# EAGLE design schematic3 (EAGLE 9.0.1)
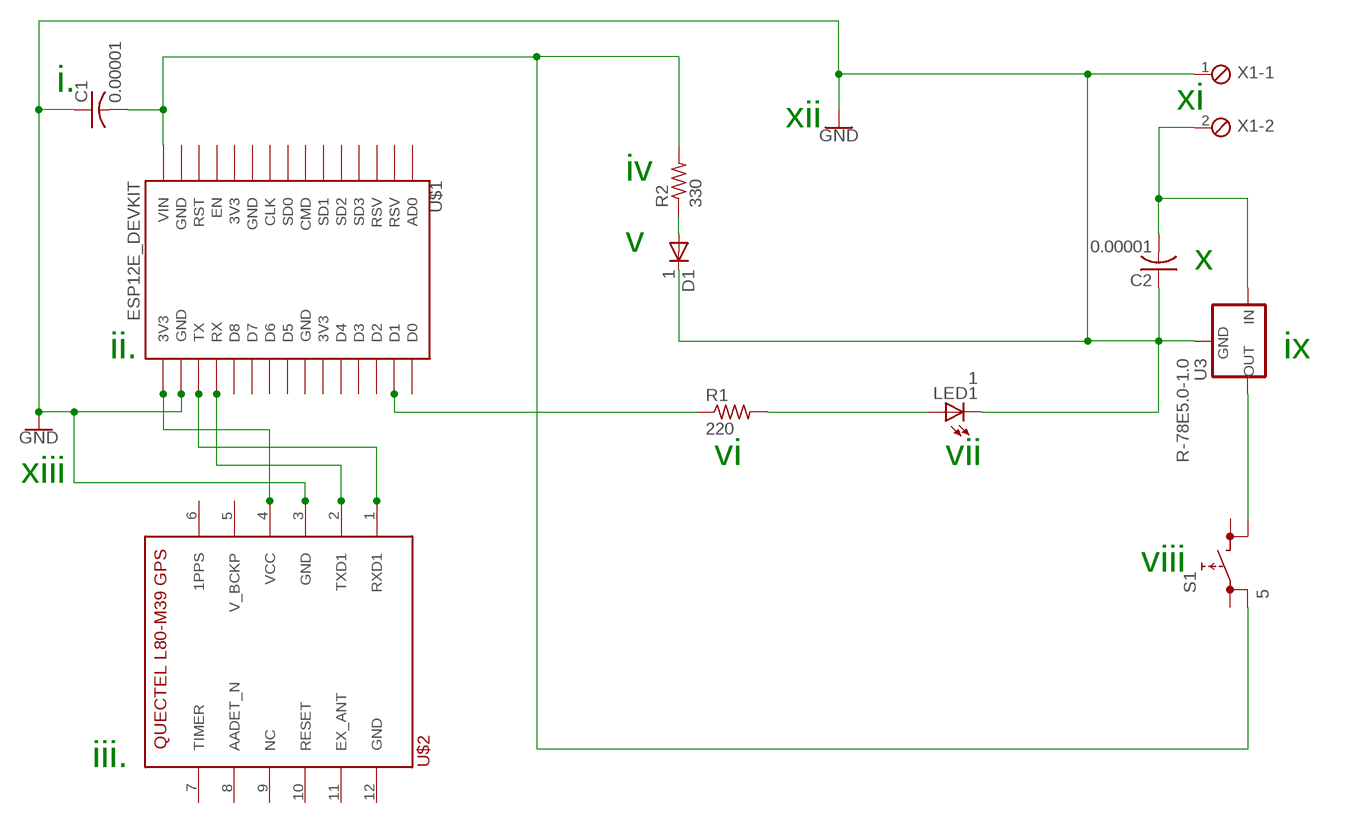
[diagram p0: schematic, sheet 1]

## Parts
C1  0.00001  C-US050-025X075  [C050-025X075]
C2  0.00001  C-US050-025X075  [C050-025X075]
D1  1  EGP10A  [DO41-10]
LED1  1  LED5MM  [LED5MM]
R1  220  R-US_0204/7  [0204/7]
R2  330  R-US_0204/7  [0204/7]
S1  5  REKN  [REKN]
U3  R-78E5.0-1.0  [DC-DC_CONVERTER_78XX]
U$1  ESP12E_DEVKIT  [ESP12E_DEVKIT]
U$2  L80_GNSS_MODULE  [L80_PACKAGE]
X1  MPT2  [2POL254]

## Nets
GND: C1.1 C2.1 D1.C LED1.K(C) U3.GND U$1.GND@3(GND) U$2.3(GND) X1.1
N$1: D1.A R2.1
N$2: C2.2 U3.VIN(IN) X1.2
N$3: S1.1B U3.VOUT(OUT)
N$4: R1.1 U$1.D1
N$5: U$1.3V3@2(3V3) U$2.4(VCC)
N$6: C1.2 R2.2 S1.0B U$1.VIN
N$7: LED1.A R1.2
N$9: U$1.RX U$2.2(TXD1)
N$10: U$1.TX U$2.1(RXD1)
Unconnected: S1.0A S1.1A U$1.3V3@0(3V3) U$1.3V3@1(3V3) U$1.AD0 U$1.CLK U$1.CMD U$1.D0 U$1.D2 U$1.D3 U$1.D4 U$1.D5 U$1.D6 U$1.D7 U$1.D8 U$1.EN U$1.GND@0(GND) U$1.GND@1(GND) U$1.GND@2(GND) U$1.RST U$1.RSV@0(RSV) U$1.RSV@1(RSV) U$1.SD0 U$1.SD1 U$1.SD2 U$1.SD3 U$2.5(V_BCKP) U$2.6(1PPS) U$2.7(TIMER) U$2.8(AADET_N) U$2.9(NC) U$2.10(RESET) U$2.11(EX_ANT) U$2.12(GND)

## Notes on the sheet
- i.
- xi
- xii
- iv
- v
- x
- ii. | ix
- vi | vii
- xiii
- viii
- iii.

## Library data of the parts
C1 C2 = resistor:C-US: CAPACITOR, American symbol
D1 = diode:EGP10A: DIODE ultra fast-recovery rectifier
LED1 = led:LED: LED OSRAM: - CHIPLED LG R971, LG N971, LY N971, LG Q971, LY Q971, LO R971, LY R971 LH N974, LH R974 LS Q976, LO Q976, LY Q976 LO Q996 - Hyper CHIPLED LW Q18S LB Q993, LB Q99A, LB R99A - SideLED LS A670, LO A670, LY A670, LG A670, LP A670 LB A673, LV A673, LT A673, LW A673 LH A674 LY A675 LS A676, LA A676, LO A676, LY A676, LW A676 LS A679, LY A679, LG A679 - Hyper Micro SIDELED® LS Y876, LA Y876, LO Y876, LY Y876 LT Y87S - SmartLED LW L88C, LW L88S LB L89C, LB L89S, LG L890 LS L89K, LO L89K, LY L89K LS L896, LA L896, LO L896, LY L896 - TOPLED LS T670, LO T670, LY T670, LG T670, LP T670 LSG T670, LSP T670, LSY T670, LOP T670, LYG T670 LG T671, LOG T671, LSG T671 LB T673, LV T673, LT T673, LW T673 LH T674 LS T676, LA T676, LO T676, LY T676, LB T676, LH T676, LSB T676, LW T676 LB T67C, LV T67C, LT T67C, LS T67K, LO T67K, LY T67K, LW E67C LS E67B, LA E67B, LO E67B, LY E67B, LB E67C, LV E67C, LT E67C LW T67C LS T679, LY T679, LG T679 LS T770, LO T770, LY T770, LG T770, LP T770 LB T773, LV T773, LT T773, LW T773 LH T774 LS E675, LA E675, LY E675, LS T675 LS T776, LA T776, LO T776, LY T776, LB T776 LHGB T686 LT T68C, LB T68C - Hyper Mini TOPLED® LB M676 - Mini TOPLED Santana® LG M470 LS M47K, LO M47K, LY M47K Source: http://www.osram.convergy.de LUXEON: - LUMILED® LXK2-PW12-R00, LXK2-PW12-S00, LXK2-PW14-U00, LXK2-PW14-V00 LXK2-PM12-R00, LXK2-PM12-S00, LXK2-PM14-U00 LXK2-PE12-Q00, LXK2-PE12-R00, LXK2-PE12-S00, LXK2-PE14-T00, LXK2-PE14-U00 LXK2-PB12-K00, LXK2-PB12-L00, LXK2-PB12-M00, LXK2-PB14-N00, LXK2-PB14-P00, LXK2-PB14-Q00 LXK2-PR12-L00, LXK2-PR12-M00, LXK2-PR14-Q00, LXK2-PR14-R00 LXK2-PD12-Q00, LXK2-PD12-R00, LXK2-PD12-S00 LXK2-PH12-R00, LXK2-PH12-S00 LXK2-PL12-P00, LXK2-PL12-Q00, LXK2-PL12-R00 Source: www.luxeon.com KINGBRIGHT: KA-3528ASYC Source: www.kingbright.com
R1 R2 = resistor:R-US_: RESISTOR, American symbol
S1 = switch:REKN: PUSH SWITCH ITT-Cannon-Cannon
U3 = SparkFun-IC-Power:R-78E5.0-1.0: Recom Power 5V 1A DC/DC Converter The Recom R-78E5.0-X.X is a compact DC/DC converter module that is a pin for pin drop-in replacement for the LM7805 linear voltage regulator. Specifications: Input Range: 7-28V Output Voltage: 5V Output Current: 1A Max Efficiency: 91% Datasheet <https://www.recom-power.com/pdf/Innoline/R-78Exx-1.0.pdf>; PROD_ID: COM-13655
U$1 = ESP12E_DEVKIT:ESP12E_DEVKIT: ESP12E DEVKIT BOARD
U$2 = Quectel:L80_GNSS_MODULE: GPS module with an embedded patch antenna (15mmx15mmx4mm)
X1 = con-phoenix-254:MPT2: PHOENIX CONNECTOR; OC_FARNELL: unknown; OC_NEWARK: unknown

## Board
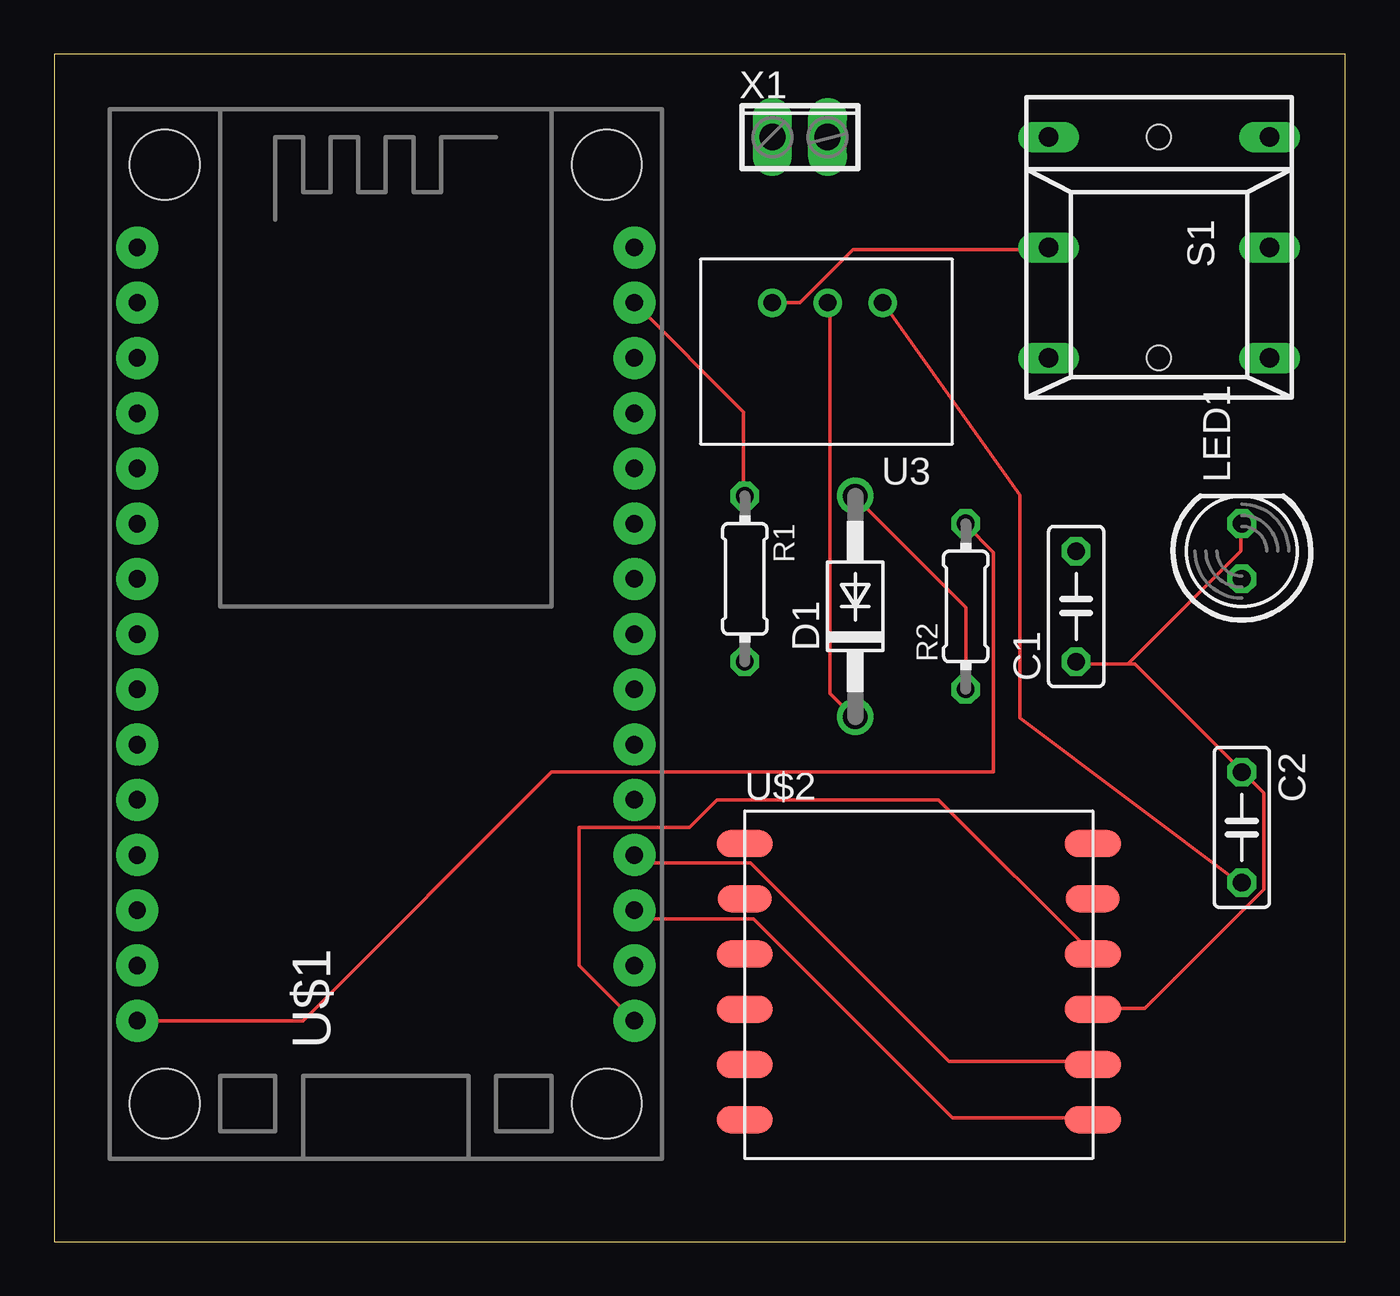
[diagram p1: board, top side]
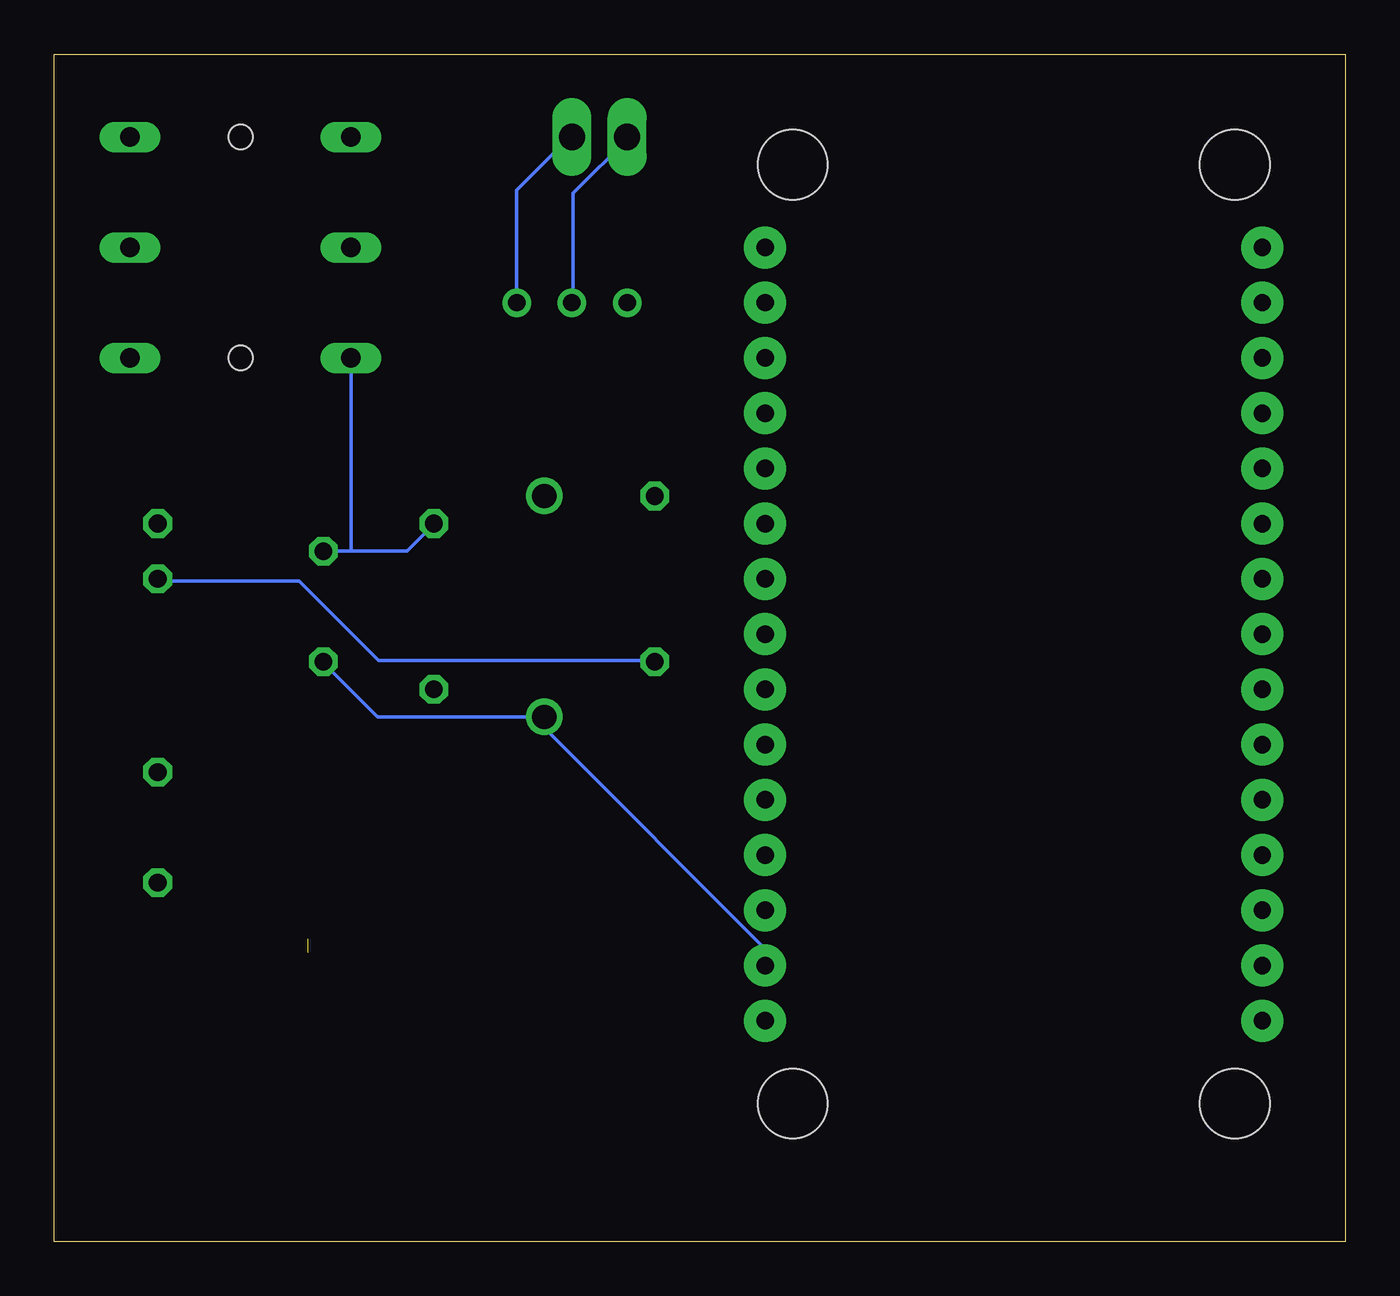
[diagram p2: board, bottom side, seen from below]

Size 59.36 x 54.6 mm. Coordinates in mm from the lower left corner, seen from the top.
Outline: 0,0 59.36,0 59.36,54.6 0,54.6 0,0
Copper layers (1*16): Top 0.035mm / dielectric 1.5mm / Bottom 0.035mm
Design rules "default": minimum track width 6mil, minimum drill 0.35mm, track to track 6mil, track to pad 6mil, pad to pad 6mil, via to via 6mil, smd to smd 6mil, copper to edge 40mil, drill to drill 6mil, minimum pad ring 10mil, minimum via ring 8mil, stop-mask expansion 4mil, vias tented up to drill 0mil, thermal gap 10mil

### Footprints (pad centres in the part's own frame; a part is rotated, then mirrored left to right if it is on the bottom)
C050-025X075 = drill 0.813 octagon: 1 -2.54,0; 2 2.54,0
DO41-10 = drill 1.118: A 5.08,0; C -5.08,0
LED5MM = drill 0.813 octagon: A -1.27,0; K 1.27,0
0204/7 = drill 0.813 octagon: 1 -3.81,0; 2 3.81,0
REKN = drill 0.9 long: 0A 5.08,5.08; 0B 5.08,-5.08; 1A 0,5.08; 1B 0,-5.08; A -5.08,5.08; B -5.08,-5.08 | hole 1.1: -5.08,0; 5.08,0
DC-DC_CONVERTER_78XX = drill 0.8: GND 0,0; VIN -2.54,0; VOUT 2.54,0
ESP12E_DEVKIT = drill 0.8 pad 1.93: 3V3@0 -11.43,-7.62; 3V3@1 11.43,5.08; 3V3@2 11.43,-17.78; AD0 -11.43,17.78; CLK -11.43,-2.54; CMD -11.43,2.54; D0 11.43,17.78; D1 11.43,15.24; D2 11.43,12.7; D3 11.43,10.16; D4 11.43,7.62; D5 11.43,0; D6 11.43,-2.54; D7 11.43,-5.08; D8 11.43,-7.62; EN -11.43,-10.16; GND@0 -11.43,-5.08; GND@1 -11.43,-15.24; GND@2 11.43,2.54; GND@3 11.43,-15.24; RST -11.43,-12.7; RSV@0 -11.43,15.24; RSV@1 -11.43,12.7; RX 11.43,-10.16; SD0 -11.43,0; SD1 -11.43,5.08; SD2 -11.43,7.62; SD3 -11.43,10.16; TX 11.43,-12.7; VIN -11.43,-17.78 | hole 3.2: -10.16,21.59; 10.16,21.59; 10.16,-21.59; -10.16,-21.59
L80_PACKAGE = smd 2.6 x 1.25: 1 16,1.8; 2 16,4.34; 3 16,6.88; 4 16,9.42; 6 16,14.5; 7 0,14.5; 9 0,9.42; 10 0,6.88; 11 0,4.34; 12 0,1.8 | smd 2.5 x 1.25: 5 16,11.96; 8 0,11.96
2POL254 = drill 1.2 long: 1 -1.27,0; 2 1.27,0

### Placement (x,y rotation side)
C1  46.99,29.21 90 top
C2  54.61,19.05 270 top
D1  36.83,29.21 90 top
LED1  54.61,31.75 90 top
R1  31.75,30.48 270 top
R2  41.91,29.21 90 top
S1  50.8,45.72 270 top
U3  35.56,43.18 180 top
U$1  15.24,27.94 0 top
U$2  31.75,3.81 0 top
X1  34.29,50.8 0 top

### Tracks (layer width: path | path; a pad name or v marks a point on that pad's centre or on a via)
GND
  Top 0.152: U$2.3 47.85,10.72 50.14,10.72 55.63,16.2 55.63,20.62 54.71,21.54 C2.1 54.56,21.69 49.68,26.57 49.38,26.57 | 49.38,26.57 47.09,26.57 C1.1 | 49.38,26.57 54.56,31.75 54.56,32.97 LED1.K | U3.GND 35.66,43.18 35.66,25.2 36.73,24.13 D1.C
  Bottom 0.152: U3.GND 35.51,43.18 35.51,48.21 32.92,50.8 X1.1 | C1.1 46.94,26.57 44.5,24.13 D1.C 36.73,24.13 36.73,23.52 26.67,13.46 U$1.GND@3
N$1
  Top 0.152: R2.1 41.91,29.16 36.88,34.19 D1.A
N$2
  Top 0.152: U3.VIN 44.4,34.34 44.4,24.08 54.56,16.46 54.56,16.51 C2.2
  Bottom 0.152: U3.VIN 38.1,48.36 35.66,50.8 X1.2
N$3
  Top 0.152: U3.VOUT 34.29,43.18 36.73,45.62 45.72,45.62 S1.1B
N$4
  Top 0.152: U$1.D1 31.7,38.15 31.7,34.34 R1.1
N$5
  Top 0.152: U$1.3V3@2 24.13,12.7 24.13,19.05 29.21,19.05 30.48,20.32 40.66,20.32 U$2.4
N$6
  Top 0.152: R2.2 41.91,32.97 43.18,31.7 43.18,21.59 22.86,21.59 11.43,10.16 U$1.VIN
  Bottom 0.152: 45.72,31.75 43.13,31.75 41.91,32.97 R2.2 | 45.72,31.75 C1.2 | 45.72,31.75 S1.0B
N$7
  Bottom 0.152: R1.2 31.85,26.72 44.45,26.72 48.11,30.38 54.56,30.38 LED1.A
N$9
  Top 0.152: U$2.2 47.7,8.28 41.15,8.28 32,17.42 26.98,17.42 26.67,17.73 U$1.RX
N$10
  Top 0.152: U$2.1 47.7,5.69 41.3,5.69 32.16,14.83 26.98,14.83 26.67,15.14 U$1.TX
S$1  (1 unrouted)